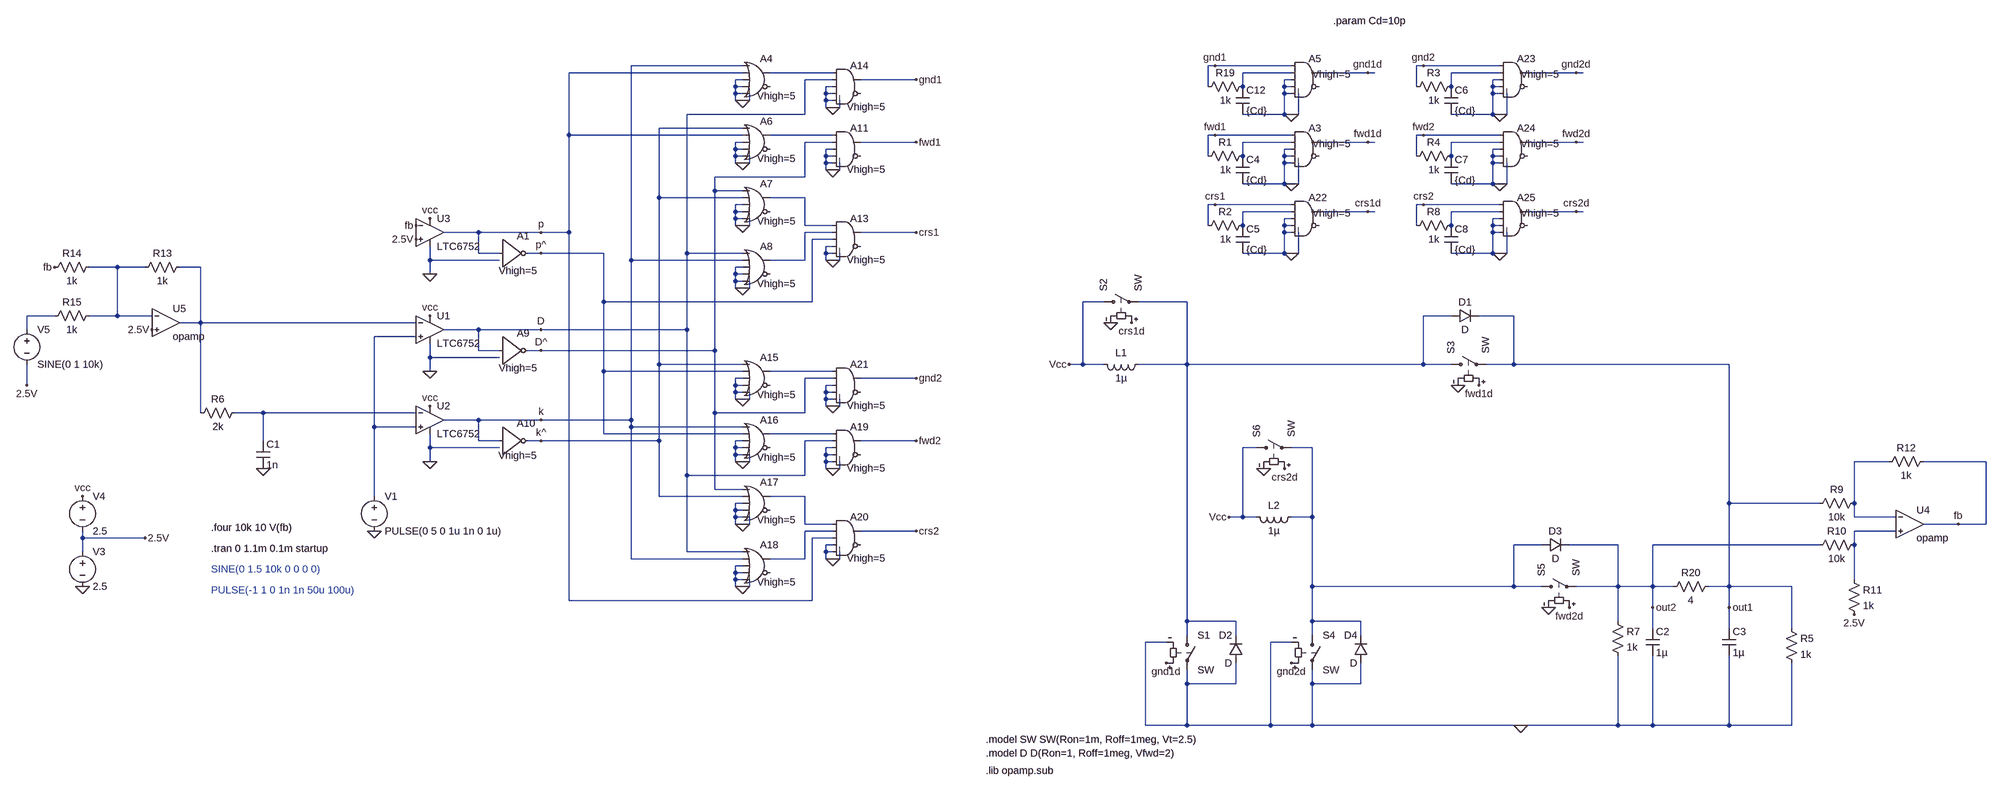
[diagram p0: schematic pwm3.asc]
pwm3.asc, the LTspice schematic file:
Version 4
SHEET 1 3908 980
WIRE 960 -880 704 -880
WIRE 2128 -880 2112 -880
WIRE 2304 -880 2128 -880
WIRE 2608 -880 2592 -880
WIRE 2784 -880 2608 -880
WIRE 960 -864 560 -864
WIRE 1168 -864 1024 -864
WIRE 2304 -864 2192 -864
WIRE 2480 -864 2368 -864
WIRE 2496 -864 2480 -864
WIRE 2784 -864 2672 -864
WIRE 2960 -864 2848 -864
WIRE 2976 -864 2960 -864
WIRE 960 -848 944 -848
WIRE 1168 -848 1104 -848
WIRE 1360 -848 1232 -848
WIRE 2304 -848 2288 -848
WIRE 2784 -848 2768 -848
WIRE 944 -832 944 -848
WIRE 960 -832 944 -832
WIRE 1168 -832 1152 -832
WIRE 2112 -832 2112 -880
WIRE 2192 -832 2192 -864
WIRE 2288 -832 2288 -848
WIRE 2304 -832 2288 -832
WIRE 2592 -832 2592 -880
WIRE 2672 -832 2672 -864
WIRE 2768 -832 2768 -848
WIRE 2784 -832 2768 -832
WIRE 944 -816 944 -832
WIRE 960 -816 944 -816
WIRE 1152 -816 1152 -832
WIRE 1168 -816 1152 -816
WIRE 2288 -816 2288 -832
WIRE 2304 -816 2288 -816
WIRE 2768 -816 2768 -832
WIRE 2784 -816 2768 -816
WIRE 944 -800 944 -816
WIRE 960 -800 944 -800
WIRE 976 -800 976 -816
WIRE 976 -800 960 -800
WIRE 1152 -800 1152 -816
WIRE 1168 -800 1152 -800
WIRE 1152 -784 1152 -800
WIRE 1168 -784 1152 -784
WIRE 1184 -784 1184 -800
WIRE 1184 -784 1168 -784
WIRE 1104 -768 1104 -848
WIRE 1104 -768 832 -768
WIRE 2288 -768 2288 -816
WIRE 2288 -768 2192 -768
WIRE 2304 -768 2288 -768
WIRE 2320 -768 2320 -816
WIRE 2320 -768 2304 -768
WIRE 2768 -768 2768 -816
WIRE 2768 -768 2672 -768
WIRE 2784 -768 2768 -768
WIRE 2800 -768 2800 -816
WIRE 2800 -768 2784 -768
WIRE 960 -736 768 -736
WIRE 560 -720 560 -864
WIRE 960 -720 560 -720
WIRE 1168 -720 1024 -720
WIRE 2128 -720 2112 -720
WIRE 2304 -720 2128 -720
WIRE 2608 -720 2592 -720
WIRE 2784 -720 2608 -720
WIRE 960 -704 944 -704
WIRE 1168 -704 1104 -704
WIRE 1360 -704 1232 -704
WIRE 2304 -704 2192 -704
WIRE 2480 -704 2368 -704
WIRE 2496 -704 2480 -704
WIRE 2784 -704 2672 -704
WIRE 2960 -704 2848 -704
WIRE 2976 -704 2960 -704
WIRE 944 -688 944 -704
WIRE 960 -688 944 -688
WIRE 1168 -688 1152 -688
WIRE 2304 -688 2288 -688
WIRE 2784 -688 2768 -688
WIRE 944 -672 944 -688
WIRE 960 -672 944 -672
WIRE 1152 -672 1152 -688
WIRE 1168 -672 1152 -672
WIRE 2112 -672 2112 -720
WIRE 2192 -672 2192 -704
WIRE 2288 -672 2288 -688
WIRE 2304 -672 2288 -672
WIRE 2592 -672 2592 -720
WIRE 2672 -672 2672 -704
WIRE 2768 -672 2768 -688
WIRE 2784 -672 2768 -672
WIRE 944 -656 944 -672
WIRE 960 -656 944 -656
WIRE 976 -656 976 -672
WIRE 976 -656 960 -656
WIRE 1152 -656 1152 -672
WIRE 1168 -656 1152 -656
WIRE 2288 -656 2288 -672
WIRE 2304 -656 2288 -656
WIRE 2768 -656 2768 -672
WIRE 2784 -656 2768 -656
WIRE 1152 -640 1152 -656
WIRE 1168 -640 1152 -640
WIRE 1184 -640 1184 -656
WIRE 1184 -640 1168 -640
WIRE 1104 -624 1104 -704
WIRE 1104 -624 896 -624
WIRE 2288 -608 2288 -656
WIRE 2288 -608 2192 -608
WIRE 2304 -608 2288 -608
WIRE 2320 -608 2320 -656
WIRE 2320 -608 2304 -608
WIRE 2768 -608 2768 -656
WIRE 2768 -608 2672 -608
WIRE 2784 -608 2768 -608
WIRE 2800 -608 2800 -656
WIRE 2800 -608 2784 -608
WIRE 896 -592 896 -624
WIRE 960 -592 896 -592
WIRE 768 -576 768 -736
WIRE 960 -576 768 -576
WIRE 1104 -576 1024 -576
WIRE 960 -560 944 -560
WIRE 2128 -560 2112 -560
WIRE 2304 -560 2128 -560
WIRE 2608 -560 2592 -560
WIRE 2784 -560 2608 -560
WIRE 944 -544 944 -560
WIRE 960 -544 944 -544
WIRE 2304 -544 2192 -544
WIRE 2480 -544 2368 -544
WIRE 2496 -544 2480 -544
WIRE 2784 -544 2672 -544
WIRE 2960 -544 2848 -544
WIRE 2976 -544 2960 -544
WIRE 944 -528 944 -544
WIRE 960 -528 944 -528
WIRE 2304 -528 2288 -528
WIRE 2784 -528 2768 -528
WIRE 944 -512 944 -528
WIRE 960 -512 944 -512
WIRE 976 -512 976 -528
WIRE 976 -512 960 -512
WIRE 1104 -512 1104 -576
WIRE 1168 -512 1104 -512
WIRE 2112 -512 2112 -560
WIRE 2192 -512 2192 -544
WIRE 2288 -512 2288 -528
WIRE 2304 -512 2288 -512
WIRE 2592 -512 2592 -560
WIRE 2672 -512 2672 -544
WIRE 2768 -512 2768 -528
WIRE 2784 -512 2768 -512
WIRE 352 -496 272 -496
WIRE 496 -496 352 -496
WIRE 560 -496 560 -720
WIRE 560 -496 496 -496
WIRE 1168 -496 1104 -496
WIRE 1360 -496 1232 -496
WIRE 2288 -496 2288 -512
WIRE 2304 -496 2288 -496
WIRE 2768 -496 2768 -512
WIRE 2784 -496 2768 -496
WIRE 1168 -480 1120 -480
WIRE 1168 -464 1152 -464
WIRE 352 -448 352 -496
WIRE 400 -448 352 -448
WIRE 496 -448 464 -448
WIRE 640 -448 496 -448
WIRE 832 -448 832 -768
WIRE 960 -448 832 -448
WIRE 1152 -448 1152 -464
WIRE 1168 -448 1152 -448
WIRE 2288 -448 2288 -496
WIRE 2288 -448 2192 -448
WIRE 2304 -448 2288 -448
WIRE 2320 -448 2320 -496
WIRE 2320 -448 2304 -448
WIRE 2768 -448 2768 -496
WIRE 2768 -448 2672 -448
WIRE 2784 -448 2768 -448
WIRE 2800 -448 2800 -496
WIRE 2800 -448 2784 -448
WIRE 240 -432 240 -464
WIRE 400 -432 240 -432
WIRE 704 -432 704 -880
WIRE 960 -432 704 -432
WIRE 1104 -432 1104 -496
WIRE 1104 -432 1024 -432
WIRE 1152 -432 1152 -448
WIRE 1168 -432 1152 -432
WIRE 1184 -432 1184 -448
WIRE 1184 -432 1168 -432
WIRE -480 -416 -544 -416
WIRE -416 -416 -480 -416
WIRE -288 -416 -336 -416
WIRE 960 -416 944 -416
WIRE 240 -400 240 -432
WIRE 944 -400 944 -416
WIRE 960 -400 944 -400
WIRE 944 -384 944 -400
WIRE 960 -384 944 -384
WIRE 944 -368 944 -384
WIRE 960 -368 944 -368
WIRE 976 -368 976 -384
WIRE 976 -368 960 -368
WIRE 640 -336 640 -448
WIRE 1120 -336 1120 -480
WIRE 1120 -336 640 -336
WIRE 1872 -336 1824 -336
WIRE 2064 -336 1952 -336
WIRE -624 -304 -688 -304
WIRE -480 -304 -480 -416
WIRE -480 -304 -544 -304
WIRE -400 -304 -480 -304
WIRE 2672 -304 2608 -304
WIRE 2816 -304 2736 -304
WIRE -288 -288 -288 -416
WIRE -288 -288 -336 -288
WIRE 208 -288 -288 -288
WIRE -688 -272 -688 -304
WIRE 352 -272 272 -272
WIRE 496 -272 352 -272
WIRE 832 -272 832 -448
WIRE 832 -272 496 -272
WIRE 208 -256 112 -256
WIRE 352 -224 352 -272
WIRE 400 -224 352 -224
WIRE 496 -224 464 -224
WIRE 896 -224 896 -592
WIRE 896 -224 496 -224
WIRE 240 -208 240 -240
WIRE 400 -208 240 -208
WIRE 768 -192 768 -576
WIRE 960 -192 768 -192
WIRE 1824 -192 1824 -336
WIRE 1824 -192 1792 -192
WIRE 1872 -192 1824 -192
WIRE 2064 -192 2064 -336
WIRE 2064 -192 1952 -192
WIRE 2608 -192 2608 -304
WIRE 2608 -192 2064 -192
WIRE 2672 -192 2608 -192
WIRE 2816 -192 2816 -304
WIRE 2816 -192 2752 -192
WIRE 3312 -192 2816 -192
WIRE 240 -176 240 -208
WIRE 640 -176 640 -336
WIRE 960 -176 640 -176
WIRE 1168 -176 1024 -176
WIRE 960 -160 944 -160
WIRE 1168 -160 1104 -160
WIRE 1360 -160 1232 -160
WIRE -688 -144 -688 -192
WIRE 944 -144 944 -160
WIRE 960 -144 944 -144
WIRE 1168 -144 1152 -144
WIRE 944 -128 944 -144
WIRE 960 -128 944 -128
WIRE 1152 -128 1152 -144
WIRE 1168 -128 1152 -128
WIRE 944 -112 944 -128
WIRE 960 -112 944 -112
WIRE 976 -112 976 -128
WIRE 976 -112 960 -112
WIRE 1152 -112 1152 -128
WIRE 1168 -112 1152 -112
WIRE 1152 -96 1152 -112
WIRE 1168 -96 1152 -96
WIRE 1184 -96 1184 -112
WIRE 1184 -96 1168 -96
WIRE -288 -80 -288 -288
WIRE -144 -80 -208 -80
WIRE 208 -80 -144 -80
WIRE 896 -80 896 -224
WIRE 1104 -80 1104 -160
WIRE 1104 -80 896 -80
WIRE 352 -64 272 -64
WIRE 496 -64 352 -64
WIRE 704 -64 704 -432
WIRE 704 -64 496 -64
WIRE 112 -48 112 -256
WIRE 208 -48 112 -48
WIRE 704 -48 704 -64
WIRE 960 -48 704 -48
WIRE 640 -32 640 -176
WIRE 960 -32 640 -32
WIRE 1168 -32 1024 -32
WIRE -144 -16 -144 -80
WIRE 352 -16 352 -64
WIRE 400 -16 352 -16
WIRE 496 -16 464 -16
WIRE 768 -16 768 -192
WIRE 768 -16 496 -16
WIRE 960 -16 944 -16
WIRE 1168 -16 1104 -16
WIRE 1360 -16 1232 -16
WIRE 240 0 240 -32
WIRE 400 0 240 0
WIRE 944 0 944 -16
WIRE 960 0 944 0
WIRE 1168 0 1152 0
WIRE 2224 0 2192 0
WIRE 2352 0 2304 0
WIRE 944 16 944 0
WIRE 960 16 944 16
WIRE 1152 16 1152 0
WIRE 1168 16 1152 16
WIRE 240 32 240 0
WIRE 944 32 944 16
WIRE 960 32 944 32
WIRE 976 32 976 16
WIRE 976 32 960 32
WIRE 1152 32 1152 16
WIRE 1168 32 1152 32
WIRE 3680 32 3600 32
WIRE 3904 32 3760 32
WIRE 1152 48 1152 32
WIRE 1168 48 1152 48
WIRE 1184 48 1184 32
WIRE 1184 48 1168 48
WIRE 832 64 832 -272
WIRE 1104 64 1104 -16
WIRE 1104 64 832 64
WIRE 896 96 896 -80
WIRE 960 96 896 96
WIRE 112 112 112 -48
WIRE 768 112 768 -16
WIRE 960 112 768 112
WIRE 1104 112 1024 112
WIRE 960 128 944 128
WIRE 3312 128 3312 -192
WIRE 3520 128 3312 128
WIRE 3600 128 3600 32
WIRE 944 144 944 128
WIRE 960 144 944 144
WIRE 944 160 944 144
WIRE 960 160 944 160
WIRE 2192 160 2192 0
WIRE 2192 160 2160 160
WIRE 2224 160 2192 160
WIRE 2352 160 2352 0
WIRE 2352 160 2304 160
WIRE 3600 160 3600 128
WIRE 3696 160 3600 160
WIRE 944 176 944 160
WIRE 960 176 944 176
WIRE 976 176 976 160
WIRE 976 176 960 176
WIRE 1104 176 1104 112
WIRE 1168 176 1104 176
WIRE 3840 176 3760 176
WIRE 3904 176 3904 32
WIRE 3904 176 3840 176
WIRE 1168 192 1104 192
WIRE 1360 192 1232 192
WIRE 3696 192 3600 192
WIRE -560 208 -560 192
WIRE -416 208 -560 208
WIRE 1168 208 1120 208
WIRE 1168 224 1152 224
WIRE 2880 224 2816 224
WIRE 3056 224 2944 224
WIRE 3520 224 3136 224
WIRE 3600 224 3600 192
WIRE -560 240 -560 208
WIRE 832 240 832 64
WIRE 960 240 832 240
WIRE 1152 240 1152 224
WIRE 1168 240 1152 240
WIRE 704 256 704 -48
WIRE 960 256 704 256
WIRE 1104 256 1104 192
WIRE 1104 256 1024 256
WIRE 1152 256 1152 240
WIRE 1168 256 1152 256
WIRE 1184 256 1184 240
WIRE 1184 256 1168 256
WIRE 960 272 944 272
WIRE 944 288 944 272
WIRE 960 288 944 288
WIRE 944 304 944 288
WIRE 960 304 944 304
WIRE 3600 304 3600 224
WIRE 944 320 944 304
WIRE 960 320 944 320
WIRE 976 320 976 304
WIRE 976 320 960 320
WIRE 2352 320 2352 160
WIRE 2816 320 2816 224
WIRE 2816 320 2352 320
WIRE 2880 320 2816 320
WIRE 3056 320 3056 224
WIRE 3056 320 2960 320
WIRE 3136 320 3136 224
WIRE 3136 320 3056 320
WIRE 3184 320 3136 320
WIRE 3312 320 3312 128
WIRE 3312 320 3264 320
WIRE 3456 320 3312 320
WIRE 560 352 560 -496
WIRE 1120 352 1120 208
WIRE 1120 352 560 352
WIRE 3136 368 3136 320
WIRE 3312 368 3312 320
WIRE 2064 400 2064 -192
WIRE 2176 400 2064 400
WIRE 2352 400 2352 320
WIRE 2464 400 2352 400
WIRE 3056 400 3056 320
WIRE 3136 416 3136 368
WIRE 3312 416 3312 368
WIRE 3456 416 3456 320
WIRE 2064 432 2064 400
WIRE 2176 432 2176 400
WIRE 2352 432 2352 400
WIRE 2464 432 2464 400
WIRE 2016 448 1968 448
WIRE 2304 448 2256 448
WIRE 2064 544 2064 512
WIRE 2176 544 2176 496
WIRE 2176 544 2064 544
WIRE 2352 544 2352 512
WIRE 2464 544 2464 496
WIRE 2464 544 2352 544
WIRE 1968 640 1968 448
WIRE 2064 640 2064 544
WIRE 2064 640 1968 640
WIRE 2256 640 2256 448
WIRE 2256 640 2064 640
WIRE 2352 640 2352 544
WIRE 2352 640 2256 640
WIRE 2832 640 2352 640
WIRE 3056 640 3056 480
WIRE 3056 640 2832 640
WIRE 3136 640 3136 480
WIRE 3136 640 3056 640
WIRE 3312 640 3312 480
WIRE 3312 640 3136 640
WIRE 3456 640 3456 496
WIRE 3456 640 3312 640
FLAG 112 192 0
FLAG -560 320 0
FLAG -560 112 vcc
FLAG 240 -304 vcc
FLAG 240 -96 vcc
FLAG 240 32 0
FLAG 240 -176 0
FLAG -144 48 0
FLAG 2832 640 0
FLAG 1792 -192 Vcc
FLAG 2160 160 Vcc
FLAG 2688 -144 0
FLAG 2240 48 0
FLAG 2896 368 0
FLAG 1888 -288 0
FLAG 496 -272 D
FLAG 496 -224 D^
FLAG 496 -64 k
FLAG 496 -16 k^
FLAG 2304 -768 0
FLAG 240 -528 vcc
FLAG 240 -400 0
FLAG 208 -480 2.5V
FLAG -416 208 2.5V
FLAG 496 -496 p
FLAG 496 -448 p^
FLAG 1360 -848 gnd1
FLAG 1360 -704 fwd1
FLAG 1360 -496 crs1
FLAG 1360 -160 gnd2
FLAG 1360 -16 fwd2
FLAG 1360 192 crs2
FLAG 960 -800 0
FLAG 960 -656 0
FLAG 960 -512 0
FLAG 960 -368 0
FLAG 1168 -640 0
FLAG 1168 -432 0
FLAG 1168 -784 0
FLAG 960 -112 0
FLAG 960 32 0
FLAG 960 176 0
FLAG 960 320 0
FLAG 1168 48 0
FLAG 1168 256 0
FLAG 1168 -96 0
FLAG 2304 -608 0
FLAG 2304 -448 0
FLAG 2784 -768 0
FLAG 2784 -608 0
FLAG 2784 -448 0
FLAG 2128 -880 gnd1
FLAG 2128 -720 fwd1
FLAG 2128 -560 crs1
FLAG 2608 -880 gnd2
FLAG 2608 -720 fwd2
FLAG 2608 -560 crs2
FLAG 2480 -864 gnd1d
FLAG 2480 -704 fwd1d
FLAG 2480 -544 crs1d
FLAG 2960 -864 gnd2d
FLAG 2960 -704 fwd2d
FLAG 2960 -544 crs2d
FLAG 2016 496 gnd1d
FLAG 2304 496 gnd2d
FLAG 2736 -144 fwd1d
FLAG 1936 -288 crs1d
FLAG 2944 368 fwd2d
FLAG 2288 48 crs2d
FLAG 3600 384 2.5V
FLAG 3840 176 fb
FLAG 208 -512 fb
FLAG -400 -272 2.5V
FLAG -688 -144 2.5V
FLAG -624 -416 fb
FLAG 3312 368 out1
FLAG 3136 368 out2
SYMBOL voltage 112 96 R0
WINDOW 123 0 0 Left 2
WINDOW 39 0 0 Left 2
SYMATTR InstName V1
SYMATTR Value PULSE(0 5 0 1u 1n 0 1u)
SYMBOL Comparators\\LTC6752 240 -128 R0
SYMATTR InstName U2
SYMBOL Comparators\\LTC6752 240 -336 R0
SYMATTR InstName U1
SYMBOL voltage -560 96 R0
WINDOW 123 0 0 Left 2
WINDOW 39 0 0 Left 2
SYMATTR InstName V4
SYMATTR Value 2.5
SYMBOL res -192 -96 R90
WINDOW 0 0 56 VBottom 2
WINDOW 3 32 56 VTop 2
SYMATTR InstName R6
SYMATTR Value 2k
SYMBOL cap -160 -16 R0
SYMATTR InstName C1
SYMATTR Value 1n
SYMBOL ind 1968 -208 R90
WINDOW 0 5 56 VBottom 2
WINDOW 3 32 56 VTop 2
SYMATTR InstName L1
SYMATTR Value 1µ
SYMBOL cap 3120 416 R0
SYMATTR InstName C2
SYMATTR Value 1µ
SYMBOL cap 3296 416 R0
SYMATTR InstName C3
SYMATTR Value 1µ
SYMBOL sw 2064 416 R0
SYMATTR InstName S1
SYMBOL sw 1856 -336 R270
SYMATTR InstName S2
SYMBOL sw 2656 -192 R270
SYMATTR InstName S3
SYMBOL diode 2192 496 R180
WINDOW 0 24 64 Left 2
WINDOW 3 24 0 Left 2
SYMATTR InstName D2
SYMBOL sw 2352 416 R0
SYMATTR InstName S4
SYMBOL diode 2480 496 R180
WINDOW 0 24 64 Left 2
WINDOW 3 24 0 Left 2
SYMATTR InstName D4
SYMBOL sw 2864 320 R270
SYMATTR InstName S5
SYMBOL sw 2208 0 R270
SYMATTR InstName S6
SYMBOL ind 2320 144 R90
WINDOW 0 5 56 VBottom 2
WINDOW 3 32 56 VTop 2
SYMATTR InstName L2
SYMATTR Value 1µ
SYMBOL Digital\\inv 400 -288 R0
WINDOW 3 -1 104 Left 2
SYMATTR Value Vhigh=5
SYMATTR InstName A9
SYMBOL Digital\\inv 400 -80 R0
WINDOW 3 -2 98 Left 2
SYMATTR Value Vhigh=5
SYMATTR InstName A10
SYMBOL res 3440 400 R0
SYMATTR InstName R5
SYMATTR Value 1k
SYMBOL res 3040 384 R0
SYMATTR InstName R7
SYMATTR Value 1k
SYMBOL Digital\\and 2336 -912 R0
WINDOW 3 16 52 Left 2
SYMATTR Value Vhigh=5
SYMATTR InstName A5
SYMBOL res 2208 -848 R90
WINDOW 0 0 56 VBottom 2
WINDOW 3 32 56 VTop 2
SYMATTR InstName R19
SYMATTR Value 1k
SYMBOL cap 2176 -832 R0
SYMATTR InstName C12
SYMATTR Value {Cd}
SYMBOL res 3280 304 R90
WINDOW 0 0 56 VBottom 2
WINDOW 3 32 56 VTop 2
SYMATTR InstName R20
SYMATTR Value 4
SYMBOL Comparators\\LTC6752 240 -560 R0
SYMATTR InstName U3
SYMBOL voltage -560 224 R0
WINDOW 123 0 0 Left 2
WINDOW 39 0 0 Left 2
SYMATTR InstName V3
SYMATTR Value 2.5
SYMBOL diode 2672 -288 R270
WINDOW 0 32 32 VTop 2
WINDOW 3 0 32 VBottom 2
SYMATTR InstName D1
SYMBOL diode 2880 240 R270
WINDOW 0 32 32 VTop 2
WINDOW 3 0 32 VBottom 2
SYMATTR InstName D3
SYMBOL Digital\\inv 400 -512 R0
WINDOW 3 -1 104 Left 2
SYMATTR Value Vhigh=5
SYMATTR InstName A1
SYMBOL Digital\\or 992 -912 R0
WINDOW 3 2 102 Left 2
SYMATTR Value Vhigh=5
SYMATTR InstName A4
SYMBOL Digital\\or 992 -768 R0
WINDOW 3 2 102 Left 2
SYMATTR Value Vhigh=5
SYMATTR InstName A6
SYMBOL Digital\\or 992 -624 R0
WINDOW 3 2 102 Left 2
SYMATTR Value Vhigh=5
SYMATTR InstName A7
SYMBOL Digital\\or 992 -480 R0
WINDOW 3 2 102 Left 2
SYMATTR Value Vhigh=5
SYMATTR InstName A8
SYMBOL Digital\\and 1200 -752 R0
WINDOW 3 0 111 Left 2
SYMATTR Value Vhigh=5
SYMATTR InstName A11
SYMBOL Digital\\and 1200 -544 R0
WINDOW 3 0 111 Left 2
SYMATTR Value Vhigh=5
SYMATTR InstName A13
SYMBOL Digital\\and 1200 -896 R0
WINDOW 3 0 111 Left 2
SYMATTR Value Vhigh=5
SYMATTR InstName A14
SYMBOL Digital\\or 992 -224 R0
WINDOW 3 2 102 Left 2
SYMATTR Value Vhigh=5
SYMATTR InstName A15
SYMBOL Digital\\or 992 -80 R0
WINDOW 3 2 102 Left 2
SYMATTR Value Vhigh=5
SYMATTR InstName A16
SYMBOL Digital\\or 992 64 R0
WINDOW 3 2 102 Left 2
SYMATTR Value Vhigh=5
SYMATTR InstName A17
SYMBOL Digital\\or 992 208 R0
WINDOW 3 2 102 Left 2
SYMATTR Value Vhigh=5
SYMATTR InstName A18
SYMBOL Digital\\and 1200 -64 R0
WINDOW 3 0 111 Left 2
SYMATTR Value Vhigh=5
SYMATTR InstName A19
SYMBOL Digital\\and 1200 144 R0
WINDOW 3 0 111 Left 2
SYMATTR Value Vhigh=5
SYMATTR InstName A20
SYMBOL Digital\\and 1200 -208 R0
WINDOW 3 0 111 Left 2
SYMATTR Value Vhigh=5
SYMATTR InstName A21
SYMBOL Digital\\and 2336 -752 R0
WINDOW 3 16 52 Left 2
SYMATTR Value Vhigh=5
SYMATTR InstName A3
SYMBOL res 2208 -688 R90
WINDOW 0 0 56 VBottom 2
WINDOW 3 32 56 VTop 2
SYMATTR InstName R1
SYMATTR Value 1k
SYMBOL cap 2176 -672 R0
SYMATTR InstName C4
SYMATTR Value {Cd}
SYMBOL Digital\\and 2336 -592 R0
WINDOW 3 16 52 Left 2
SYMATTR Value Vhigh=5
SYMATTR InstName A22
SYMBOL res 2208 -528 R90
WINDOW 0 0 56 VBottom 2
WINDOW 3 32 56 VTop 2
SYMATTR InstName R2
SYMATTR Value 1k
SYMBOL cap 2176 -512 R0
SYMATTR InstName C5
SYMATTR Value {Cd}
SYMBOL Digital\\and 2816 -912 R0
WINDOW 3 16 52 Left 2
SYMATTR Value Vhigh=5
SYMATTR InstName A23
SYMBOL res 2688 -848 R90
WINDOW 0 0 56 VBottom 2
WINDOW 3 32 56 VTop 2
SYMATTR InstName R3
SYMATTR Value 1k
SYMBOL cap 2656 -832 R0
SYMATTR InstName C6
SYMATTR Value {Cd}
SYMBOL Digital\\and 2816 -752 R0
WINDOW 3 16 52 Left 2
SYMATTR Value Vhigh=5
SYMATTR InstName A24
SYMBOL res 2688 -688 R90
WINDOW 0 0 56 VBottom 2
WINDOW 3 32 56 VTop 2
SYMATTR InstName R4
SYMATTR Value 1k
SYMBOL cap 2656 -672 R0
SYMATTR InstName C7
SYMATTR Value {Cd}
SYMBOL Digital\\and 2816 -592 R0
WINDOW 3 16 52 Left 2
SYMATTR Value Vhigh=5
SYMATTR InstName A25
SYMBOL res 2688 -528 R90
WINDOW 0 0 56 VBottom 2
WINDOW 3 32 56 VTop 2
SYMATTR InstName R8
SYMATTR Value 1k
SYMBOL cap 2656 -512 R0
SYMATTR InstName C8
SYMATTR Value {Cd}
SYMBOL Opamps\\opamp 3728 112 R0
SYMATTR InstName U4
SYMBOL res 3616 112 R90
WINDOW 0 0 56 VBottom 2
WINDOW 3 32 56 VTop 2
SYMATTR InstName R9
SYMATTR Value 10k
SYMBOL res 3616 208 R90
WINDOW 0 0 56 VBottom 2
WINDOW 3 32 56 VTop 2
SYMATTR InstName R10
SYMATTR Value 10k
SYMBOL res 3584 288 R0
SYMATTR InstName R11
SYMATTR Value 1k
SYMBOL res 3776 16 R90
WINDOW 0 0 56 VBottom 2
WINDOW 3 32 56 VTop 2
SYMATTR InstName R12
SYMATTR Value 1k
SYMBOL voltage -688 -288 R0
WINDOW 123 0 0 Left 2
WINDOW 39 0 0 Left 2
SYMATTR InstName V5
SYMATTR Value SINE(0 1 10k)
SYMBOL Opamps\\opamp -368 -352 R0
SYMATTR InstName U5
SYMBOL res -320 -432 R90
WINDOW 0 0 56 VBottom 2
WINDOW 3 32 56 VTop 2
SYMATTR InstName R13
SYMATTR Value 1k
SYMBOL res -528 -432 R90
WINDOW 0 0 56 VBottom 2
WINDOW 3 32 56 VTop 2
SYMATTR InstName R14
SYMATTR Value 1k
SYMBOL res -528 -320 R90
WINDOW 0 0 56 VBottom 2
WINDOW 3 32 56 VTop 2
SYMATTR InstName R15
SYMATTR Value 1k
TEXT -264 232 Left 2 !.tran 0 1.1m 0.1m startup
TEXT 1600 672 Left 2 !.model SW SW(Ron=1m, Roff=1meg, Vt=2.5)
TEXT 1600 704 Left 2 !.model D D(Ron=1, Roff=1meg, Vfwd=2)
TEXT 2400 -984 Left 2 !.param Cd=10p
TEXT 1600 744 Left 2 !.lib opamp.sub
TEXT -264 280 Left 2 ;SINE(0 1.5 10k 0 0 0 0)
TEXT -264 328 Left 2 ;PULSE(-1 1 0 1n 1n 50u 100u)
TEXT -264 184 Left 2 !.four 10k 10 V(fb)

The netlist it stands for:
* pwm3.asc
V1 N015 0 PULSE(0 5 0 1u 1n 0 1u)
XU2 N015 N017 vcc 0 k LTC6752  ; pins In+ In- V+ V- OUT
XU1 N015 N012 vcc 0 D LTC6752  ; pins In+ In- V+ V- OUT
V4 vcc 2.5V 2.5
R6 N017 N012 2k
C1 N017 0 1n
L1 N013 vcc 1µ
C2 out2 0 1µ
C3 out1 0 1µ
S1 N013 0 gnd1d 0 SW
S2 vcc N013 crs1d 0 SW
S3 N013 out1 fwd1d 0 SW
D2 0 N013 D
S4 N019 0 gnd2d 0 SW
D4 0 N019 D
S5 N019 out2 fwd2d 0 SW
S6 vcc N019 crs2d 0 SW
L2 N019 vcc 1µ
A9 D 0 0 0 0 D^ 0 0 BUF Vhigh=5
A10 k 0 0 0 0 k^ 0 0 BUF Vhigh=5
R5 out1 0 1k
R7 out2 0 1k
A5 gnd1 N002 0 0 0 0 gnd1d 0 AND Vhigh=5
R19 N002 gnd1 1k
C12 N002 0 {Cd}
R20 out1 out2 4
XU3 2.5V fb vcc 0 p LTC6752  ; pins In+ In- V+ V- OUT
V3 2.5V 0 2.5
D1 N013 out1 D
D3 N019 out2 D
A1 p 0 0 0 0 p^ 0 0 BUF Vhigh=5
A4 k p 0 0 0 0 N001 0 OR Vhigh=5
A6 k^ p 0 0 0 0 N004 0 OR Vhigh=5
A7 D^ k^ 0 0 0 0 N007 0 OR Vhigh=5
A8 D k 0 0 0 0 N010 0 OR Vhigh=5
A11 N004 D^ 0 0 0 0 fwd1 0 AND Vhigh=5
A13 N007 N010 p^ 0 0 0 crs1 0 AND Vhigh=5
A14 N001 D 0 0 0 0 gnd1 0 AND Vhigh=5
A15 k^ p^ 0 0 0 0 N016 0 OR Vhigh=5
A16 k p^ 0 0 0 0 N018 0 OR Vhigh=5
A17 D^ k^ 0 0 0 0 N021 0 OR Vhigh=5
A18 D k 0 0 0 0 N022 0 OR Vhigh=5
A19 N018 D 0 0 0 0 fwd2 0 AND Vhigh=5
A20 N021 N022 p 0 0 0 crs2 0 AND Vhigh=5
A21 N016 D^ 0 0 0 0 gnd2 0 AND Vhigh=5
A3 fwd1 N005 0 0 0 0 fwd1d 0 AND Vhigh=5
R1 N005 fwd1 1k
C4 N005 0 {Cd}
A22 crs1 N008 0 0 0 0 crs1d 0 AND Vhigh=5
R2 N008 crs1 1k
C5 N008 0 {Cd}
A23 gnd2 N003 0 0 0 0 gnd2d 0 AND Vhigh=5
R3 N003 gnd2 1k
C6 N003 0 {Cd}
A24 fwd2 N006 0 0 0 0 fwd2d 0 AND Vhigh=5
R4 N006 fwd2 1k
C7 N006 0 {Cd}
A25 crs2 N009 0 0 0 0 crs2d 0 AND Vhigh=5
R8 N009 crs2 1k
C8 N009 0 {Cd}
XU4 N020 N023 fb opamp Aol=100K GBW=10Meg  ; pins invin noninvin out
R9 N020 out1 10k
R10 N023 out2 10k
R11 N023 2.5V 1k
R12 fb N020 1k
V5 N014 2.5V SINE(0 1 10k)
XU5 N011 2.5V N012 opamp Aol=100K GBW=10Meg  ; pins invin noninvin out
R13 N012 N011 1k
R14 N011 fb 1k
R15 N011 N014 1k
.model D D
.lib standard.dio
.tran 0 1.1m 0.1m startup
.model SW SW(Ron=1m, Roff=1meg, Vt=2.5)
.model D D(Ron=1, Roff=1meg, Vfwd=2)
.param Cd=10p
.lib opamp.sub
* SINE(0 1.5 10k 0 0 0 0)
* PULSE(-1 1 0 1n 1n 50u 100u)
.four 10k 10 V(fb)
.lib LTC7.lib
.backanno
.end